# Altium schematic sheet mcu.SchDoc
size A; SheetNumber: 4; SheetTotal: 5
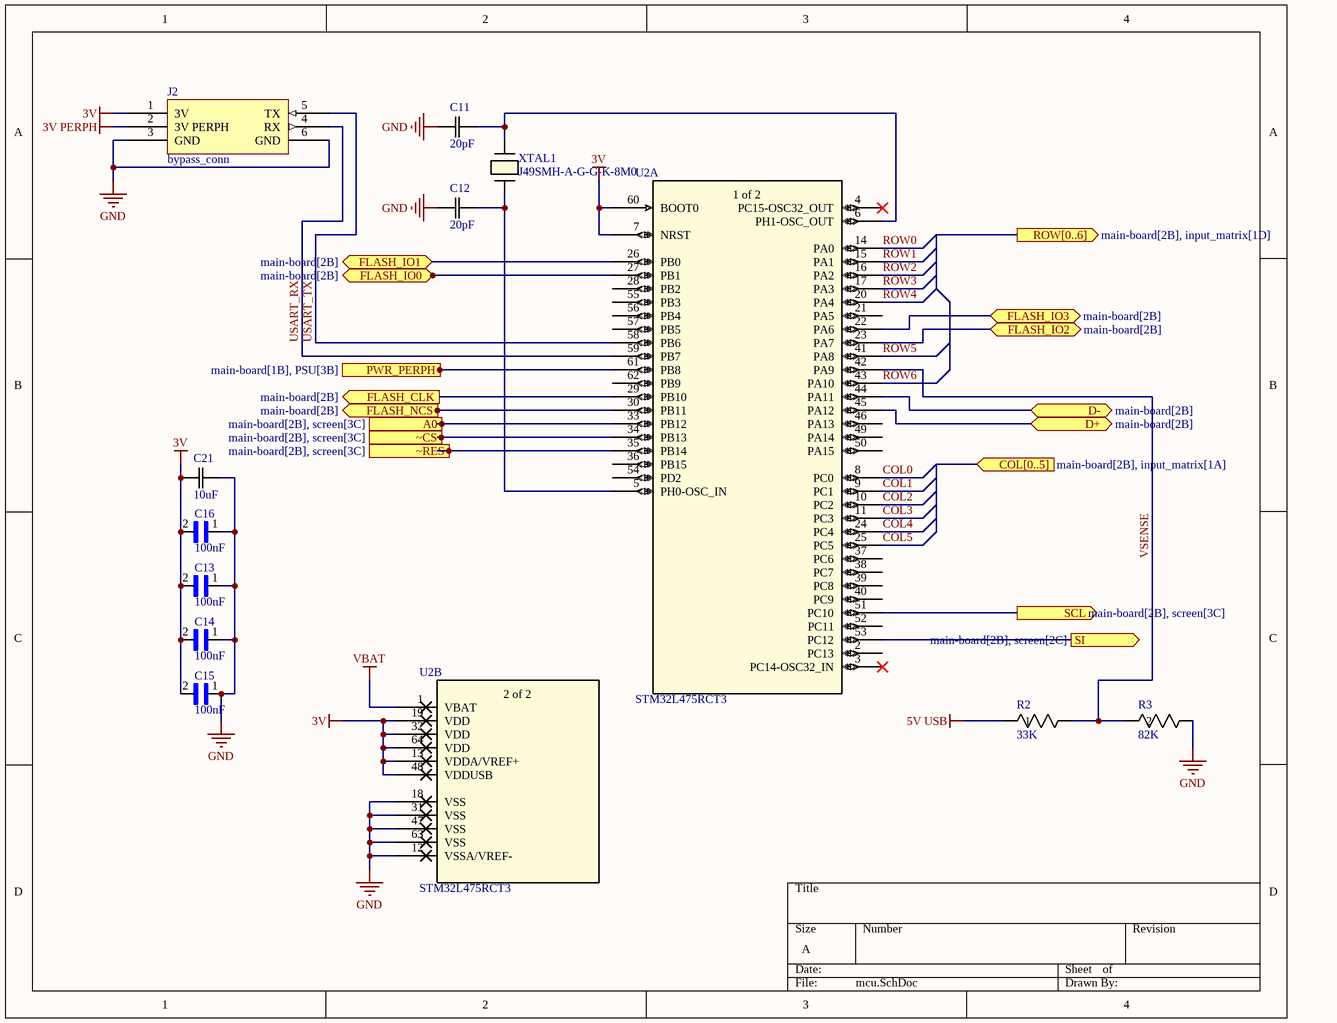
[diagram p0: mcu.SchDoc]

## Parts
C11  20pF  [CAP_CL10_SAM]
C12  20pF  [CAP_CL10_SAM]
C13  100nF  [CAPC1005X55N]
C14  100nF  [CAPC1005X55N]
C15  100nF  [CAPC1005X55N]
C16  100nF  [CAPC1005X55N]
C21  10uF  [CAP_CL10_SAM]
J2  bypass_conn  [bypass_conn]
R2  33K  [STA_RMCF0603_STP]
R3  82K  [RC0603N_YAG]
U2  STM32L475RCT3  [LQFP64-10x10mm]  (parts A,B of 2)
XTAL1  J49SMH-A-G-G-K-8M0  [XTAL_J49SMH-A-G-G-K-8M0_JAU]

## Ports
A0 (out, see main-board[2B], screen[3C]), COL[0..5] (in, see main-board[2B], input_matrix[1A]), D+ (bidir, see main-board[2B]), D- (bidir, see main-board[2B]), FLASH_CLK (out, see main-board[2B]), FLASH_IO0 (bidir, see main-board[2B]), FLASH_IO1 (bidir, see main-board[2B]), FLASH_IO2 (bidir, see main-board[2B]), FLASH_IO3 (bidir, see main-board[2B]), FLASH_NCS (out, see main-board[2B]), PWR_PERPH (out, see main-board[1B], PSU[3B]), ROW[0..6] (out, see main-board[2B], input_matrix[1D]), SCL (out, see main-board[2B], screen[3C]), SI (out, see main-board[2B], screen[2C]), ~CS (out, see main-board[2B], screen[3C]), ~RES (out, see main-board[2B], screen[3C])

## Nets
3V: C13.2 C14.2 C15.2 C16.2 C21.1 J2.1(3V) U2.7(NRST) U2.13(VDDA/VREF+) U2.19(VDD) U2.32(VDD) U2.48(VDDUSB) U2.60(BOOT0) U2.64(VDD)
3V PERPH: J2.2(3V_PERPH)
5V USB: R2.1
GND: C11.1 C12.1 C13.1 C14.1 C15.1 C16.1 C21.2 J2.3(GND) J2.6(GND) R3.1 U2.12(VSSA/VREF-) U2.18(VSS) U2.31(VSS) U2.47(VSS) U2.63(VSS)
VBAT: U2.1(VBAT)
A0: U2.33(PB12) ; port A0
COL0: U2.8(PC0)
COL1: U2.9(PC1)
COL2: U2.10(PC2)
COL3: U2.11(PC3)
COL4: U2.24(PC4)
COL5: U2.25(PC5)
D+: U2.45(PA12) ; port D+
D-: U2.44(PA11) ; port D-
FLASH_CLK: U2.29(PB10) ; port FLASH_CLK
FLASH_IO0: U2.27(PB1) ; port FLASH_IO0
FLASH_IO1: U2.26(PB0) ; port FLASH_IO1
FLASH_IO2: U2.23(PA7) ; port FLASH_IO2
FLASH_IO3: U2.22(PA6) ; port FLASH_IO3
FLASH_NCS: U2.30(PB11) ; port FLASH_NCS
PWR_PERPH: U2.61(PB8) ; port PWR_PERPH
ROW0: U2.14(PA0)
ROW1: U2.15(PA1)
ROW2: U2.16(PA2)
ROW3: U2.17(PA3)
ROW4: U2.20(PA4)
ROW5: U2.41(PA8)
ROW6: U2.43(PA10)
SCL: U2.51(PC10) ; port SCL
SI: U2.53(PC12) ; port SI
USART_RX: J2.4(RX) U2.59(PB7)
USART_TX: J2.5(TX) U2.58(PB6)
VSENSE: R2.2 R3.2 U2.42(PA9)
~CS: U2.34(PB13) ; port ~CS
~RES: U2.35(PB14) ; port ~RES
NetC11_2: C11.2 U2.6(PH1-OSC_OUT) XTAL1.2
NetC12_2: C12.2 U2.5(PH0-OSC_IN) XTAL1.1

Not connected (* = marked no-connect by the designer): U2 2(PC13) 3(PC14-OSC32_IN)* 4(PC15-OSC32_OUT)* 21(PA5) 28(PB2) 36(PB15) 37(PC6) 38(PC7) 39(PC8) 40(PC9) 46(PA13) 49(PA14) 50(PA15) 52(PC11) 54(PD2) 55(PB3) 56(PB4) 57(PB5) 62(PB9)

## Notes on the sheet
- (in symbol STM32L475RCT3, part A) 1 of 2
- (in symbol STM32L475RCT3, part B) 2 of 2

## Library data of the parts
C11 C12 = CL10C200JB8NNNC: Mfr_Name: Samsung
C13-C16 = CL05B104KP5NNNC: 0.1ÂµF Â±10% 10V Ceramic Capacitor X7R 0402 _1005 Metric_; MF: Samsung Electro-Mechanics; MP: CL05B104KP5NNNC; Availability: Unavailable; SnapEDA_Link: https://www.snapeda.com/parts/CL05B104KP5NNNC/Samsung%20Electro-Mechanics/view-part/1365387/?ref=snap; Package: 0402 Samsung; Price: None; Value: *
C21 = CL10A106KQ8NNNL: Mfr_Name: Samsung
J2 = bypass_conn: Bypass connector for power supply and backup chip programming
R2 = RMCF0603FT33K0: Mfr_Name: Stackpole International
R3 = RC0603FR-0782KL: Mfr_Name: Yageo
U2 = STM32L475RCT3: STM32 - 256KB, 128KB RAM, USB OTG, QUAD SPI / https://www.st.com/en/microcontrollers-microprocessors/stm32l475rc.html#overview; Mfr_Name: STMicroelectronics; RefDes: RefDes; Type: Type
XTAL1 = J49SMH-A-G-G-K-8M0: No Description Available; Mfr_Name: Jauch